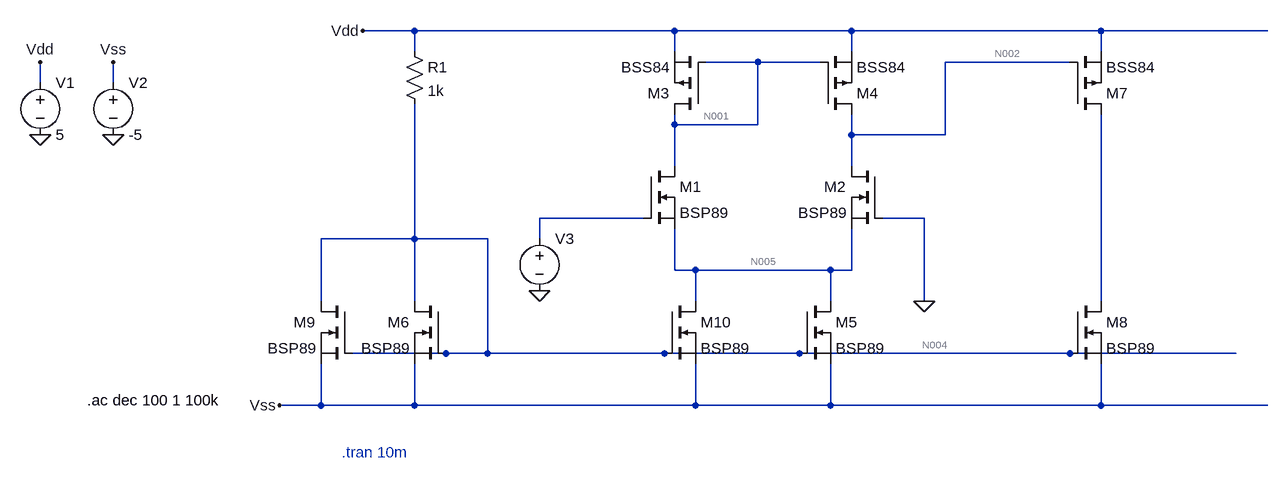
[diagram p0: schematic 2 stage opamp.asc]
2 stage opamp.asc, the LTspice schematic file:
Version 4.1
SHEET 1 1424 740
WIRE -272 -240 -352 -240
WIRE 128 -240 -272 -240
WIRE 400 -240 128 -240
WIRE 784 -240 400 -240
WIRE 1040 -240 784 -240
WIRE -272 -208 -272 -240
WIRE 128 -208 128 -240
WIRE 400 -208 400 -240
WIRE 784 -208 784 -240
WIRE 256 -192 176 -192
WIRE 352 -192 256 -192
WIRE 736 -192 544 -192
WIRE -848 -160 -848 -192
WIRE -736 -160 -736 -192
WIRE 128 -96 128 -112
WIRE 256 -96 256 -192
WIRE 256 -96 128 -96
WIRE 400 -80 400 -112
WIRE 544 -80 544 -192
WIRE 544 -80 400 -80
WIRE 128 -32 128 -96
WIRE 400 -32 400 -80
WIRE 80 48 -80 48
WIRE 512 48 448 48
WIRE -272 80 -272 -128
WIRE -272 80 -416 80
WIRE -160 80 -272 80
WIRE -80 80 -80 48
WIRE 128 128 128 64
WIRE 160 128 128 128
WIRE 368 128 160 128
WIRE 400 128 400 64
WIRE 400 128 368 128
WIRE -416 176 -416 80
WIRE -272 176 -272 80
WIRE 160 176 160 128
WIRE 368 176 368 128
WIRE 512 176 512 48
WIRE 784 176 784 -112
WIRE -224 256 -368 256
WIRE -160 256 -160 80
WIRE -160 256 -224 256
WIRE 112 256 -160 256
WIRE 320 256 112 256
WIRE 736 256 320 256
WIRE 992 256 736 256
WIRE -416 336 -416 272
WIRE -416 336 -480 336
WIRE -272 336 -272 272
WIRE -272 336 -416 336
WIRE 160 336 160 272
WIRE 160 336 -272 336
WIRE 368 336 368 272
WIRE 368 336 160 336
WIRE 784 336 784 272
WIRE 784 336 368 336
WIRE 1040 336 784 336
FLAG -80 160 0
FLAG -848 -80 0
FLAG -736 -80 0
FLAG -848 -192 Vdd
FLAG -736 -192 Vss
FLAG -352 -240 Vdd
FLAG -480 336 Vss
FLAG 512 176 0
SYMBOL nmos 80 -32 R0
SYMATTR InstName M1
SYMATTR Value BSP89
SYMBOL nmos 448 -32 M0
SYMATTR InstName M2
SYMATTR Value BSP89
SYMBOL pmos 176 -112 R180
SYMATTR InstName M3
SYMATTR Value BSS84
SYMBOL pmos 352 -112 M180
SYMATTR InstName M4
SYMATTR Value BSS84
SYMBOL nmos 320 176 R0
SYMATTR InstName M5
SYMATTR Value BSP89
SYMBOL voltage -80 64 R0
WINDOW 3 24 96 Invisible 2
WINDOW 39 0 0 Left 0
SYMATTR Value SINE(0 1m 1k 0 0 0 1k)
SYMATTR InstName V3
SYMATTR Value2 AC 1 0
SYMBOL voltage -848 -176 R0
WINDOW 123 0 0 Left 0
WINDOW 39 0 0 Left 0
SYMATTR InstName V1
SYMATTR Value 5
SYMBOL voltage -736 -176 R0
WINDOW 123 0 0 Left 0
WINDOW 39 0 0 Left 0
SYMATTR InstName V2
SYMATTR Value -5
SYMBOL nmos -224 176 M0
SYMATTR InstName M6
SYMATTR Value BSP89
SYMBOL nmos 736 176 R0
SYMATTR InstName M8
SYMATTR Value BSP89
SYMBOL res -288 -224 R0
SYMATTR InstName R1
SYMATTR Value 1k
SYMBOL pmos 736 -112 M180
SYMATTR InstName M7
SYMATTR Value BSS84
SYMBOL nmos -368 176 M0
SYMATTR InstName M9
SYMATTR Value BSP89
SYMBOL nmos 112 176 R0
SYMATTR InstName M10
SYMATTR Value BSP89
TEXT -384 408 Left 2 ;.tran 10m
TEXT -776 328 Left 2 !.ac dec 100 1 100k

The netlist it stands for:
* 2 stage opamp.asc
M1 N001 N003 N005 N005 BSP89
M2 N002 0 N005 N005 BSP89
M3 N001 N001 Vdd Vdd BSS84
M4 N002 N001 Vdd Vdd BSS84
M5 N005 N004 Vss Vss BSP89
V3 N003 0 SINE(0 1m 1k 0 0 0 1k) AC 1 0
V1 Vdd 0 5
V2 Vss 0 -5
M6 N004 N004 Vss Vss BSP89
M8 N006 N004 Vss Vss BSP89
R1 Vdd N004 1k
M7 N006 N002 Vdd Vdd BSS84
M9 N004 N004 Vss Vss BSP89
M10 N005 N004 Vss Vss BSP89
.model NMOS NMOS
.model PMOS PMOS
.lib standard.mos
* .tran 10m
.ac dec 100 1 100k
.backanno
.end

* Results of the author's LTspice run, read from the files saved beside the schematic
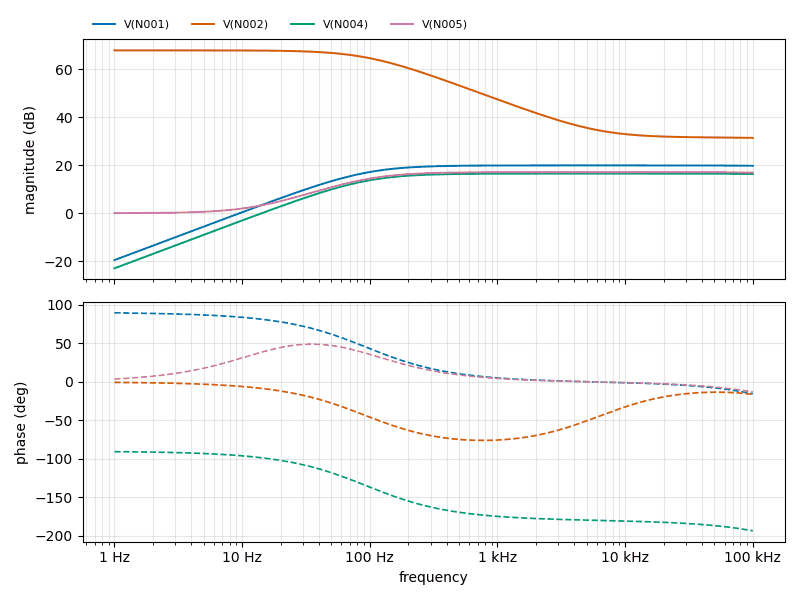
[diagram p1: AC Analysis of 2 stage opamp.asc, plotted from the saved traces]
* AC Analysis, 1 run:
*   V(N001): -19.58 dB at 1 Hz, 19.72 dB at 100 kHz, peak 19.89 dB at 6.918 kHz, 3 dB below the peak at 94.15 Hz
*   V(N002): 67.85 dB at 1 Hz, 31.37 dB at 100 kHz, peak 67.85 dB at 1 Hz, 3 dB below the peak at 94.2 Hz
*   V(N004): -23.01 dB at 1 Hz, 16.30 dB at 100 kHz, peak 16.47 dB at 6.761 kHz, 3 dB below the peak at 94.15 Hz
*   V(N005): 0.02 dB at 1 Hz, 16.92 dB at 100 kHz, peak 17.10 dB at 6.761 kHz, 3 dB below the peak at 92.29 Hz